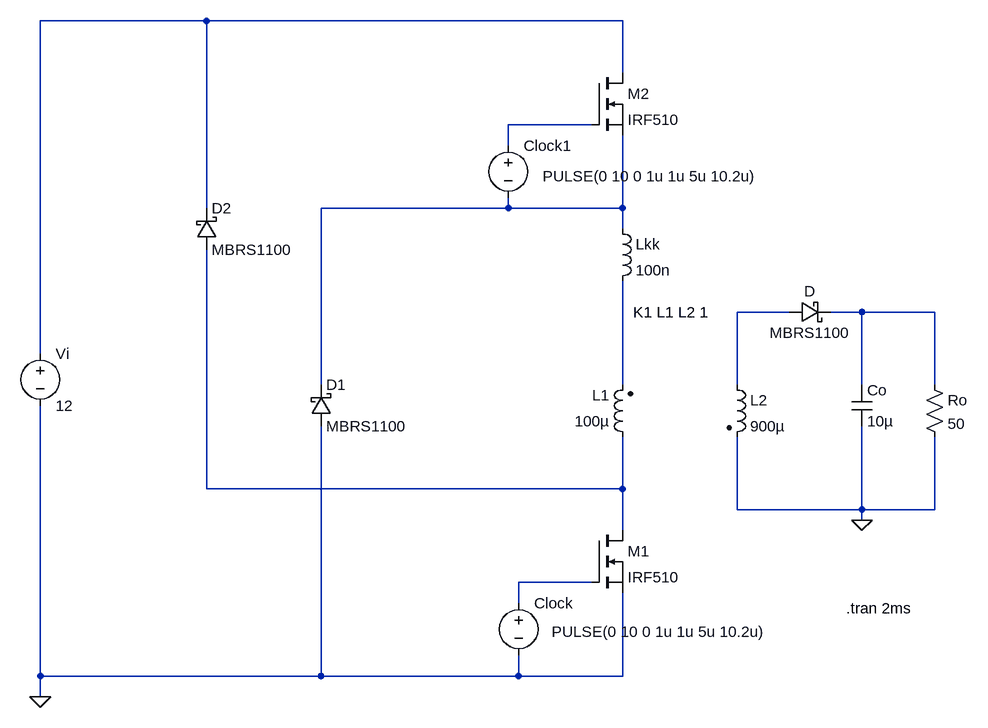
[diagram p0: schematic Flyback_clamp_tris.asc]
Flyback_clamp_tris.asc, the LTspice schematic file:
Version 4.1
SHEET 1 880 720
WIRE -592 -544 -848 -544
WIRE 48 -544 -592 -544
WIRE 48 -464 48 -544
WIRE 0 -384 -128 -384
WIRE -128 -352 -128 -384
WIRE -592 -256 -592 -544
WIRE -128 -256 -128 -272
WIRE -128 -256 -416 -256
WIRE 48 -256 48 -368
WIRE 48 -256 -128 -256
WIRE 48 -224 48 -256
WIRE 304 -96 224 -96
WIRE 416 -96 368 -96
WIRE 528 -96 416 -96
WIRE -848 -32 -848 -544
WIRE -416 16 -416 -256
WIRE 48 16 48 -144
WIRE 224 16 224 -96
WIRE 416 16 416 -96
WIRE 528 16 528 -96
WIRE -592 176 -592 -192
WIRE 48 176 48 96
WIRE 48 176 -592 176
WIRE 224 208 224 96
WIRE 416 208 416 80
WIRE 416 208 224 208
WIRE 528 208 528 96
WIRE 528 208 416 208
WIRE 416 224 416 208
WIRE 48 240 48 176
WIRE 0 320 -112 320
WIRE -112 352 -112 320
WIRE -848 464 -848 48
WIRE -416 464 -416 80
WIRE -416 464 -848 464
WIRE -112 464 -112 432
WIRE -112 464 -416 464
WIRE 48 464 48 336
WIRE 48 464 -112 464
WIRE -848 496 -848 464
FLAG 416 224 0
FLAG -848 496 0
SYMBOL cap 400 16 R0
SYMATTR InstName Co
SYMATTR Value 10µ
SYMBOL res 512 0 R0
SYMATTR InstName Ro
SYMATTR Value 50
SYMBOL voltage -112 336 R0
WINDOW 123 0 0 Left 2
WINDOW 39 0 0 Left 2
WINDOW 3 51 60 Left 2
SYMATTR InstName Clock
SYMATTR Value PULSE(0 10 0 1u 1u 5u 10.2u)
SYMBOL voltage -848 -48 R0
WINDOW 123 0 0 Left 2
WINDOW 39 0 0 Left 2
SYMATTR InstName Vi
SYMATTR Value 12
SYMBOL schottky 304 -112 M90
WINDOW 0 0 32 VBottom 2
WINDOW 3 32 32 VTop 2
SYMATTR InstName D
SYMATTR Value MBRS1100
SYMATTR Description Diode
SYMATTR Type diode
SYMBOL ind2 64 112 R180
WINDOW 0 36 80 Left 2
WINDOW 3 36 40 Left 2
SYMATTR InstName L1
SYMATTR Value 100µ
SYMBOL ind2 208 0 R0
SYMATTR InstName L2
SYMATTR Value 900µ
SYMBOL nmos 0 240 R0
SYMATTR InstName M1
SYMATTR Value IRF510
SYMBOL schottky -432 80 M180
WINDOW 0 24 64 Left 2
WINDOW 3 24 0 Left 2
SYMATTR InstName D1
SYMATTR Value MBRS1100
SYMATTR Description Diode
SYMATTR Type diode
SYMBOL schottky -608 -192 M180
WINDOW 0 24 64 Left 2
WINDOW 3 24 0 Left 2
SYMATTR InstName D2
SYMATTR Value MBRS1100
SYMATTR Description Diode
SYMATTR Type diode
SYMBOL ind 32 -240 R0
SYMATTR InstName Lkk
SYMATTR Value 100n
SYMBOL nmos 0 -464 R0
SYMATTR InstName M2
SYMATTR Value IRF510
SYMBOL voltage -128 -368 R0
WINDOW 123 0 0 Left 2
WINDOW 39 0 0 Left 2
WINDOW 3 53 63 Left 2
SYMATTR InstName Clock1
SYMATTR Value PULSE(0 10 0 1u 1u 5u 10.2u)
TEXT 392 360 Left 2 !.tran 2ms
TEXT 64 -96 Left 2 !K1 L1 L2 1

The netlist it stands for:
* Flyback_clamp_tris.asc
Co N005 0 10µ
Ro N005 0 50
V§Clock N008 0 PULSE(0 10 0 1u 1u 5u 10.2u)
Vi N001 0 12
D N004 N005 MBRS1100
L1 N007 N006 100µ
L2 N004 0 900µ
M1 N007 N008 0 0 IRF510
D1 0 N003 MBRS1100
D2 N007 N001 MBRS1100
Lkk N003 N006 100n
M2 N001 N002 N003 N003 IRF510
V§Clock1 N002 N003 PULSE(0 10 0 1u 1u 5u 10.2u)
.model D D
.lib standard.dio
.model NMOS NMOS
.model PMOS PMOS
.lib standard.mos
.tran 2ms
K1 L1 L2 1
.backanno
.end